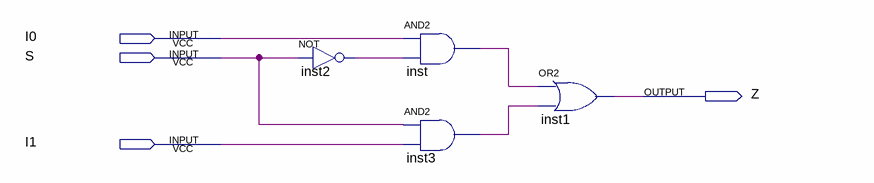
[diagram p0: schematic sheet]
// Quartus schematic mux_2x1.bdf as structural Verilog: 4 symbols, 4 pins
module mux_2x1 (
  input  I0,
  input  S,
  input  I1,
  output Z
);

  wire inst2_out, inst3_out, inst_out;

  not inst2 (inst2_out, S);
  and inst (inst_out, I0, inst2_out);
  and inst3 (inst3_out, S, I1);
  or inst1 (Z, inst_out, inst3_out);
endmodule
